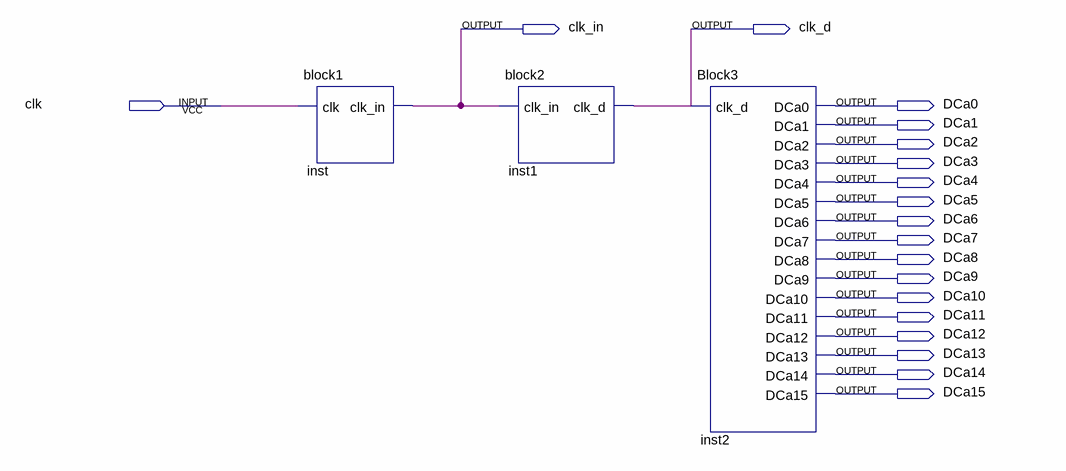
[diagram p0: schematic sheet]
// Quartus schematic lab2.bdf as structural Verilog: 3 symbols, 19 pins
module lab2 (
  input  clk,
  output clk_in,
  output clk_d,
  output DCa0,
  output DCa1,
  output DCa2,
  output DCa3,
  output DCa4,
  output DCa5,
  output DCa6,
  output DCa7,
  output DCa8,
  output DCa9,
  output DCa10,
  output DCa11,
  output DCa12,
  output DCa13,
  output DCa14,
  output DCa15
);

  block1 inst (.clk(clk), .clk_in(clk_in));
  block2 inst1 (.clk_in(clk_in), .clk_d(clk_d));
  Block3 inst2 (
    .clk_d(clk_d), .DCa0(DCa0), .DCa1(DCa1), .DCa2(DCa2), .DCa3(DCa3), .DCa4(DCa4), .DCa5(DCa5), .DCa6(DCa6),
    .DCa7(DCa7), .DCa8(DCa8), .DCa9(DCa9), .DCa10(DCa10), .DCa11(DCa11), .DCa12(DCa12), .DCa13(DCa13),
    .DCa14(DCa14), .DCa15(DCa15));
endmodule
